# EAGLE schematic FuseOne-electronics (EAGLE 6.5.0)
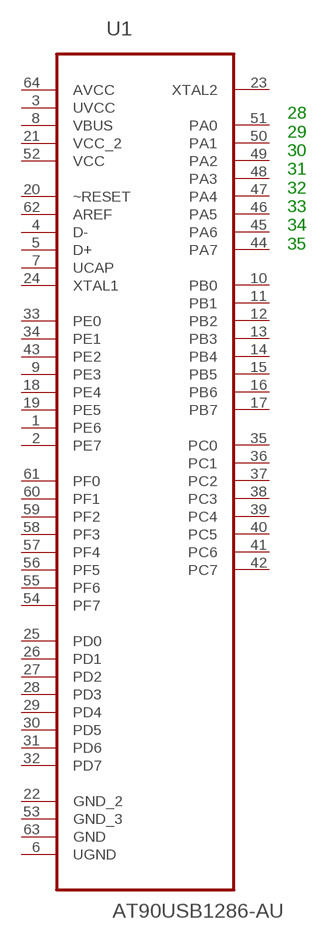
[diagram p0: schematic, sheet 1]

## Parts
U1  AT90USB1286-AU  [QFP80P1600X1600X120-64N]
Unconnected: U1.1(PE6) U1.2(PE7) U1.4(D-) U1.5(D+) U1.6(UGND) U1.7(UCAP) U1.9(PE3) U1.10(PB0) U1.11(PB1) U1.12(PB2) U1.13(PB3) U1.14(PB4) U1.15(PB5) U1.16(PB6) U1.17(PB7) U1.18(PE4) U1.19(PE5) U1.20(~RESET) U1.22(GND_2) U1.23(XTAL2) U1.24(XTAL1) U1.25(PD0) U1.26(PD1) U1.27(PD2) U1.28(PD3) U1.29(PD4) U1.30(PD5) U1.31(PD6) U1.32(PD7) U1.33(PE0) U1.34(PE1) U1.35(PC0) U1.36(PC1) U1.37(PC2) U1.38(PC3) U1.39(PC4) U1.40(PC5) U1.41(PC6) U1.42(PC7) U1.43(PE2) U1.44(PA7) U1.45(PA6) U1.46(PA5) U1.47(PA4) U1.48(PA3) U1.49(PA2) U1.50(PA1) U1.51(PA0) U1.53(GND_3) U1.54(PF7) U1.55(PF6) U1.56(PF5) U1.57(PF4) U1.58(PF3) U1.59(PF2) U1.60(PF1) U1.61(PF0) U1.62(AREF) U1.63(GND)

## Notes on the sheet
- 28
  29
  30
  31
  32
  33
  34
  35

## Power pins joined to a net without a drawn wire
AVCC: U1.64(AVCC)
UVCC: U1.3(UVCC)
VBUS: U1.8(VBUS)
VCC: U1.52(VCC)
VCC_2: U1.21(VCC_2)

## Library data of the parts
U1 = Atmel_By_element14_Batch_1-00:AT90USB1286-AU: MCU; DESCRIPTION: MCU; MPN: AT90USB1286-AU; OC_FARNELL: 1748495; OC_NEWARK: 26R5675; PACKAGE: QFP-64; SUPPLIER: Atmel